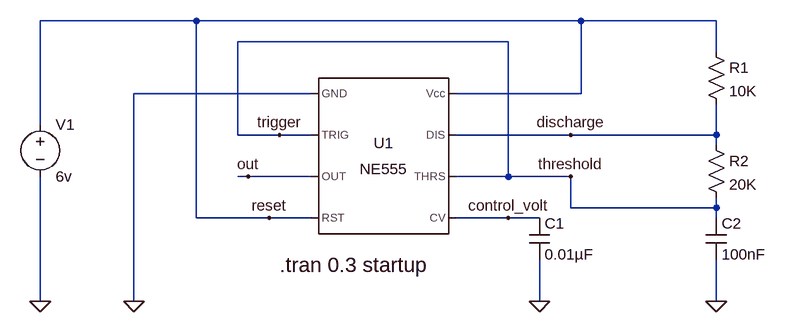
[diagram p0: schematic timer555_astable_.asc]
timer555_astable_.asc, the LTspice schematic file:
Version 4
SHEET 1 1828 1348
WIRE -256 -48 -496 -48
WIRE 336 -48 -256 -48
WIRE 544 -48 336 -48
WIRE 224 -16 -192 -16
WIRE 544 0 544 -48
WIRE -80 64 -352 64
WIRE 336 64 336 -48
WIRE 336 64 144 64
WIRE -496 112 -496 -48
WIRE -192 128 -192 -16
WIRE -128 128 -192 128
WIRE -80 128 -128 128
WIRE 320 128 144 128
WIRE 544 128 544 80
WIRE 544 128 320 128
WIRE 544 144 544 128
WIRE -176 192 -192 192
WIRE -80 192 -176 192
WIRE 224 192 224 -16
WIRE 224 192 144 192
WIRE 320 192 224 192
WIRE 320 240 320 192
WIRE 544 240 544 224
WIRE 544 240 320 240
WIRE -256 256 -256 -48
WIRE -144 256 -256 256
WIRE -80 256 -144 256
WIRE 224 256 144 256
WIRE 272 256 224 256
WIRE 544 256 544 240
WIRE -496 384 -496 192
WIRE -352 384 -352 64
WIRE 272 384 272 320
WIRE 544 384 544 320
FLAG -352 384 0
FLAG 272 384 0
FLAG 544 384 0
FLAG 320 128 discharge
FLAG -496 384 0
FLAG 320 192 threshold
FLAG -128 128 trigger
FLAG -144 256 reset
FLAG 224 256 control_volt
FLAG -176 192 out
SYMBOL Misc\\NE555 32 160 R0
SYMATTR InstName U1
SYMBOL cap 256 256 R0
SYMATTR InstName C1
SYMATTR Value 0.01µF
SYMBOL res 528 -16 R0
SYMATTR InstName R1
SYMATTR Value 10K
SYMATTR SpiceLine tol=1 pwr=0.1
SYMBOL res 528 128 R0
SYMATTR InstName R2
SYMATTR Value 20K
SYMATTR SpiceLine tol=1 pwr=0.1
SYMBOL cap 528 256 R0
SYMATTR InstName C2
SYMATTR Value 100nF
SYMATTR SpiceLine V=25 Irms=0 Rser=0.007 Lser=0
SYMBOL voltage -496 96 R0
WINDOW 123 0 0 Left 0
WINDOW 39 0 0 Left 0
SYMATTR InstName V1
SYMATTR Value 6v
TEXT -128 328 Left 3 !.tran 0.3 startup

The netlist it stands for:
* timer555_astable_.asc
XU1 0 trigger out reset control_volt trigger discharge reset NE555  ; pins GND TRIG OUT RST CV THRS DIS Vcc
C1 control_volt 0 0.01µF
R1 reset discharge 10K tol=1 pwr=0.1
R2 discharge trigger 20K tol=1 pwr=0.1
C2 trigger 0 100nF V=25 Irms=0 Rser=0.007 Lser=0
V1 reset 0 6v
.tran 0.3 startup
.lib NE555.sub
.backanno
.end